# Altium schematic sheet Pegasus.SchDoc
size Tabloid; SheetNumber: 2; SheetTotal: 3
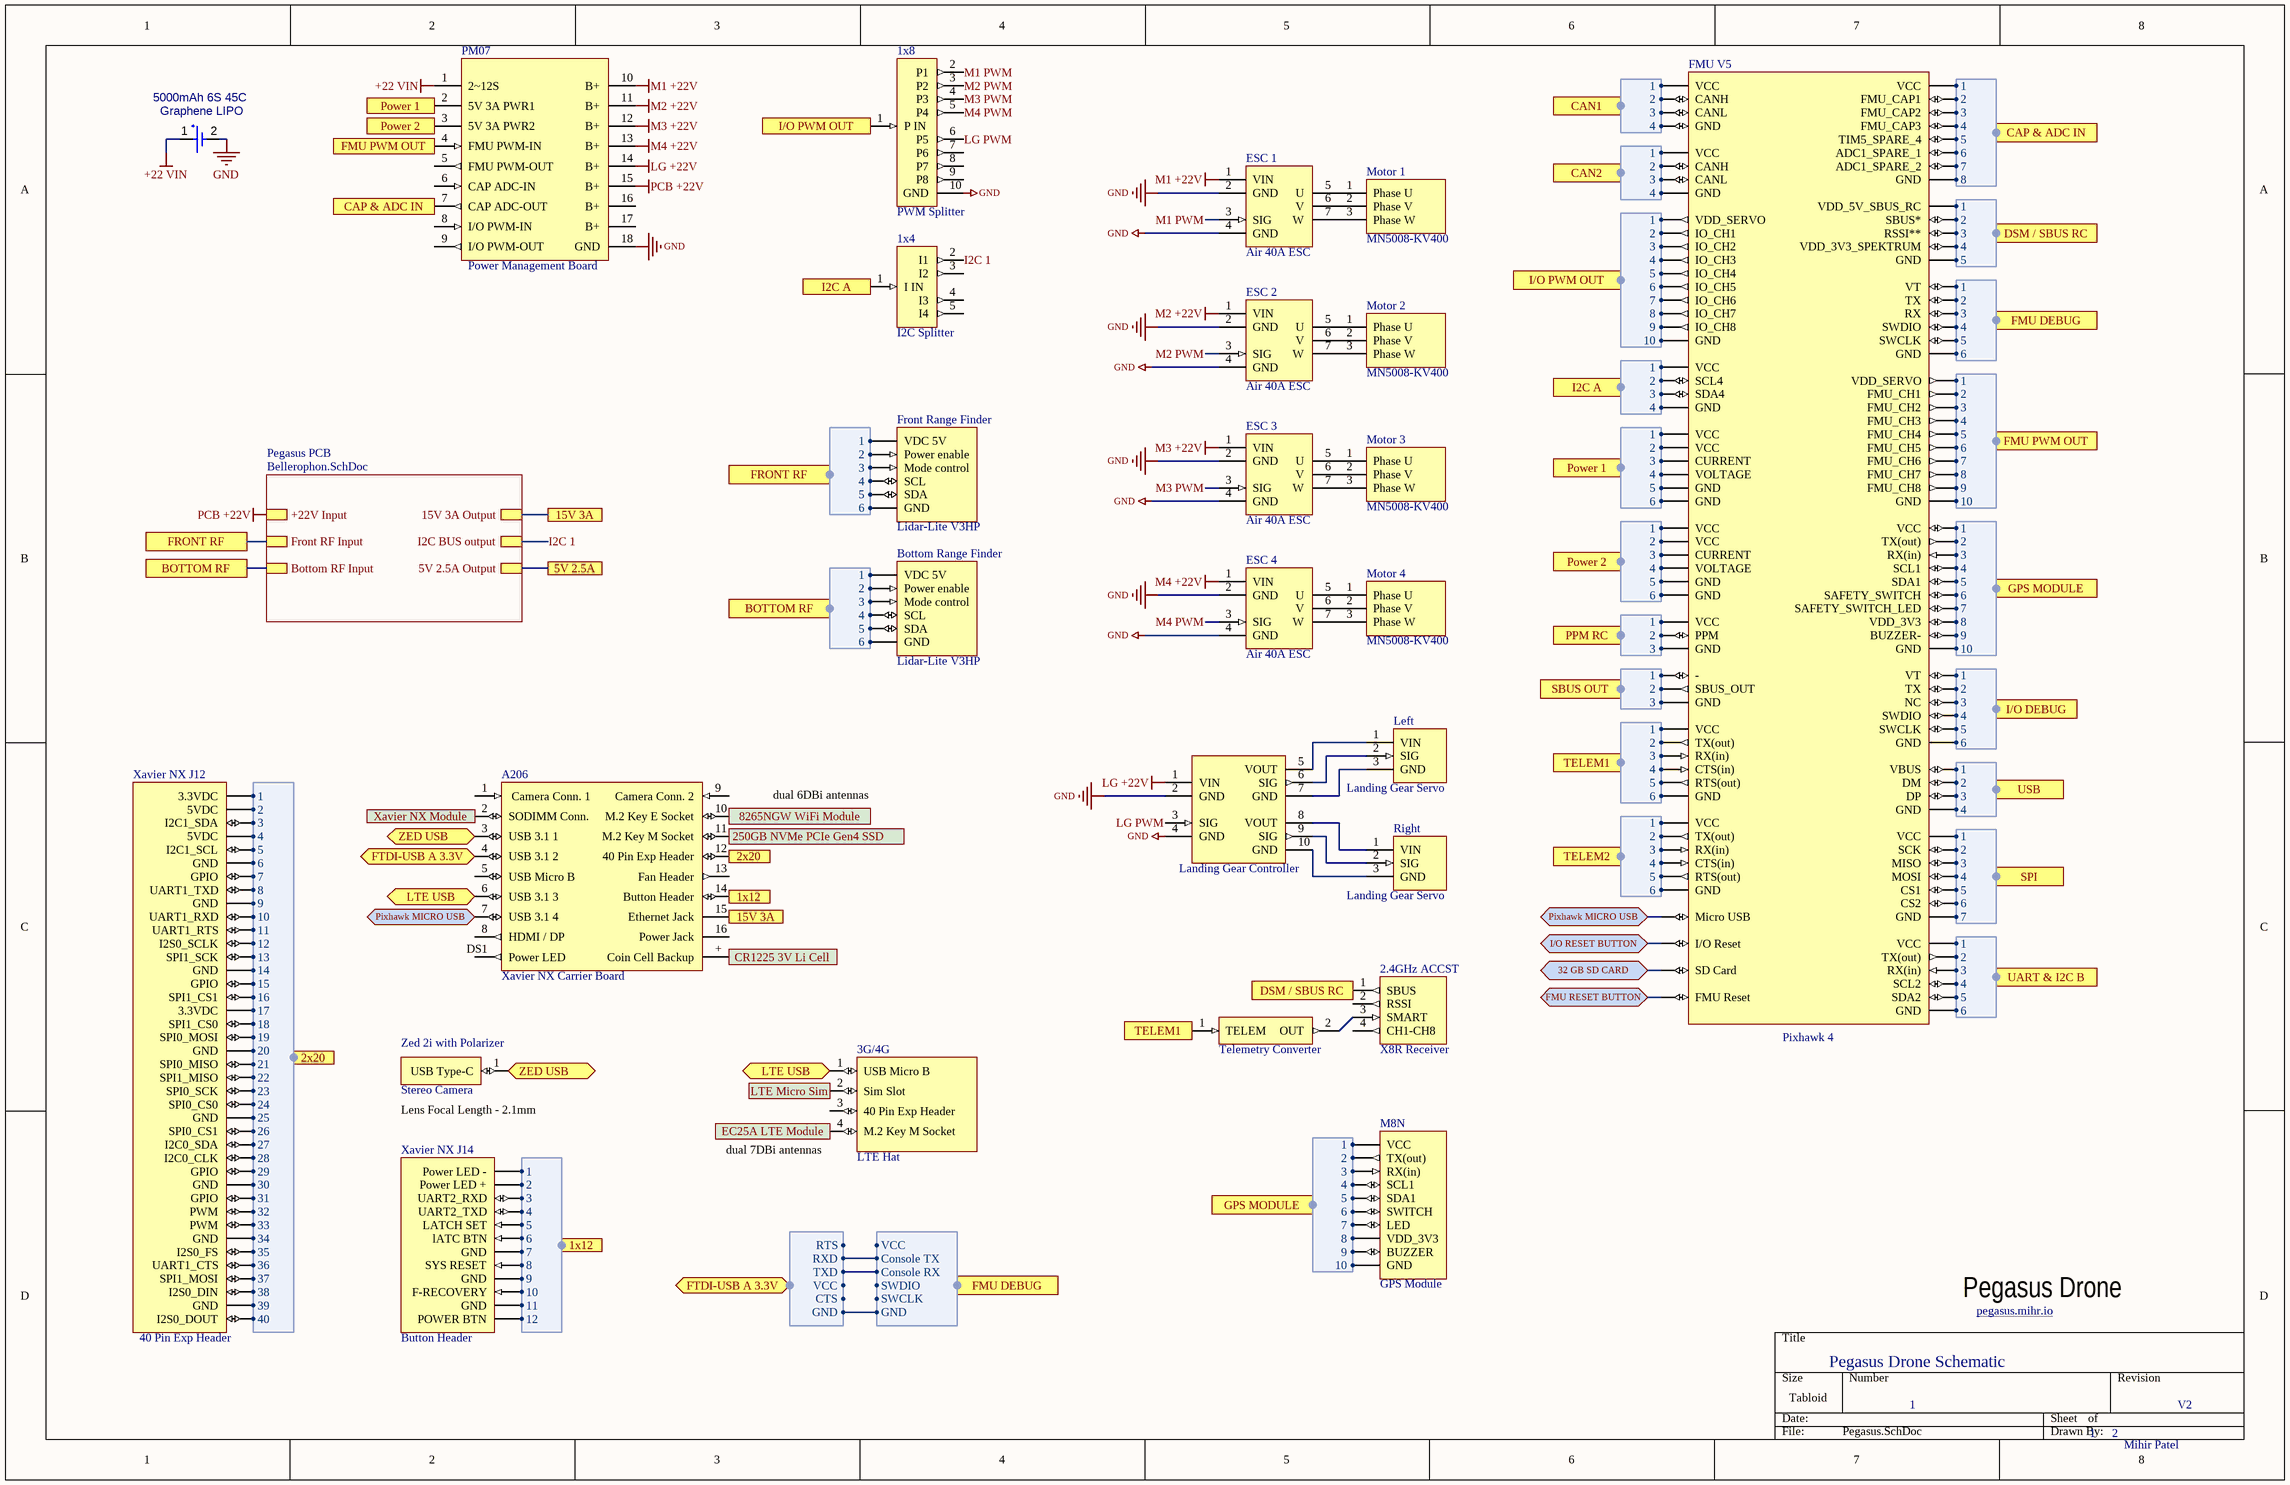
[diagram p0: Pegasus.SchDoc]

## Parts
1x4  I2C Splitter
1x8  PWM Splitter
2.4GHz_ACCST  X8R Receiver
3G/4G  LTE Hat
5000mAh_6S_45C  Graphene LIPO  [SEIK-MS621FE-FL11E-2_V]
A206  Xavier NX Carrier Board
Bottom_Range_Finder  Lidar-Lite V3HP
ESC_1  Air 40A ESC
ESC_2  Air 40A ESC
ESC_3  Air 40A ESC
ESC_4  Air 40A ESC
FMU_V5  Pixhawk 4
Front_Range_Finder  Lidar-Lite V3HP
Left  Landing Gear Servo
LGC  Landing Gear Controller
M8N  GPS Module
Motor_1  MN5008-KV400
Motor_2  MN5008-KV400
Motor_3  MN5008-KV400
Motor_4  MN5008-KV400
PM07  Power Management Board
Right  Landing Gear Servo
TC1  Telemetry Converter
Xavier_NX_J12  40 Pin Exp Header
Xavier_NX_J14  Button Header
Zed_2i_with_Polarizer  Stereo Camera

## Sub-sheets
Pegasus PCB = Bellerophon.SchDoc: 15V 3A Output, +22V Input, Front RF Input, Bottom RF Input, I2C BUS output, 5V 2.5A Output

## Ports
1x12 (harness 1x12), 1x12 (harness *), 2x20 (harness NX), 5V 2.5A, 15V 3A, 32 GB SD CARD (bidir), 250GB NVMe PCIe Gen4 SSD, 8265NGW WiFi Module, BOTTOM RF (harness L2), CAN1 (harness CAN1), CAN2 (harness CAN2), CAP & ADC IN (harness CAP & ADC IN), CR1225 3V Li Cell, DSM / SBUS RC (harness DSM / SBUS RC), EC25A LTE Module, FMU DEBUG (harness FDD), FMU DEBUG (harness FMU DEBUG), FMU PWM OUT (harness FMU PWM OUT), FMU RESET BUTTON (bidir), FRONT RF (harness L1), FTDI-USB A 3.3V (bidir, harness USBD), GPS MODULE (harness GPS MODULE), GPS MODULE (harness GPS), I2C A (harness I2C A), I/O DEBUG (harness IO DEBUG), I/O PWM OUT (harness I/O PWM OUT), I/O RESET BUTTON (bidir), LTE Micro Sim, LTE USB (bidir), Pixhawk MICRO USB (bidir), Power 1 (harness Power 1), Power 2 (harness Power 2), PPM RC (harness PPM RC), SBUS OUT (harness SBUS OUT), SPI (harness SPI), TELEM1 (harness TELEM1), TELEM2 (harness TELEM2), UART & I2C B (harness UART & I2C B), USB (harness USB), Xavier NX Module, ZED USB (bidir)

## Harnesses
CAP & ADC IN: 1, 2, 3, 4, 5, 6, 7, 8
DSM / SBUS RC: 1, 2, 3, 4, 5
FMU DEBUG: 1, 2, 3, 4, 5, 6
FMU PWM OUT: 1, 2, 3, 4, 5, 6, 7, 8, 9, 10
IO DEBUG: 1, 2, 3, 4, 5, 6
SPI: 1, 2, 3, 4, 5, 6, 7
CAN1: 1, 2, 3, 4
CAN2: 1, 2, 3, 4
I/O PWM OUT: 1, 2, 3, 4, 5, 6, 7, 8, 9, 10
I2C A: 1, 2, 3, 4
Power 1: 1, 2, 3, 4, 5, 6
Power 2: 1, 2, 3, 4, 5, 6
SBUS OUT: 1, 2, 3
TELEM1: 1, 2, 3, 4, 5, 6
TELEM2: 1, 2, 3, 4, 5, 6
GPS MODULE: 1, 2, 3, 4, 5, 6, 7, 8, 9, 10
PPM RC: 1, 2, 3
USB: 1, 2, 3, 4
UART & I2C B: 1, 2, 3, 4, 5, 6
L1: 1, 2, 3, 4, 5, 6
L2: 1, 2, 3, 4, 5, 6
GPS: 1, 2, 3, 4, 5, 6, 7, 8, 9, 10
NX: 1, 2, 3, 4, 5, 6, 7, 8, 9, 10, 11, 12, 13, 14, 15, 16, 17, 18, 19, 20, 21, 22, 23, 24, 25, 26, 27, 28, 29, 30, 31, 32, 33, 34, 35, 36, 37, 38, 39, 40
1x12: 1, 2, 3, 4, 5, 6, 7, 8, 9, 10, 11, 12
FDD: VCC, Console TX, Console RX, SWDIO, SWCLK, GND
USBD: GND, CTS, VCC, TXD, RXD, RTS

## Nets
+22 VIN: 5000mAh_6S_45C.1(+) PM07.1(2~12S)
GND: 1x8.10(GND) 5000mAh_6S_45C.2(-) ESC_1.2(GND) ESC_1.4(GND) ESC_2.2(GND) ESC_2.4(GND) ESC_3.2(GND) ESC_3.4(GND) ESC_4.2(GND) ESC_4.4(GND) LGC.2(GND) LGC.4(GND) PM07.18(GND)
LG +22V: LGC.1(VIN) PM07.14(B+)
M1 +22V: ESC_1.1(VIN) PM07.10(B+)
M2 +22V: ESC_2.1(VIN) PM07.11(B+)
M3 +22V: ESC_3.1(VIN) PM07.12(B+)
M4 +22V: ESC_4.1(VIN) PM07.13(B+)
PCB +22V: PM07.15(B+) ; sheet Pegasus PCB/+22V Input
5V 2.5A: port 5V 2.5A, sheet Pegasus PCB/5V 2.5A Output
15V 3A: A206.15(Ethernet_Jack) ; port 15V 3A, sheet Pegasus PCB/15V 3A Output
32 GB SD CARD: FMU_V5.117(SD_Card) ; port 32 GB SD CARD
250GB NVMe PCIe Gen4 SSD: A206.11(M.2_Key_M_Socket) ; port 250GB NVMe PCIe Gen4 SSD
8265NGW WiFi Module: A206.10(M.2_Key_E_Socket) ; port 8265NGW WiFi Module
CR1225 3V Li Cell: A206.+(Coin_Cell_Backup) ; port CR1225 3V Li Cell
EC25A LTE Module: 3G/4G.4(M.2_Key_M_Socket) ; port EC25A LTE Module
FMU RESET BUTTON: FMU_V5.118(FMU_Reset) ; port FMU RESET BUTTON
I2C 1: 1x4.2(I1) ; sheet Pegasus PCB/I2C BUS output
I/O RESET BUTTON: FMU_V5.116(I/O_Reset) ; port I/O RESET BUTTON
LG PWM: 1x8.6(P5) LGC.3(SIG)
LTE Micro Sim: 3G/4G.2(Sim_Slot) ; port LTE Micro Sim
LTE USB: 3G/4G.1(USB_Micro_B) A206.6(USB_3.1_3) ; port LTE USB
M1 PWM: 1x8.2(P1) ESC_1.3(SIG)
M2 PWM: 1x8.3(P2) ESC_2.3(SIG)
M3 PWM: 1x8.4(P3) ESC_3.3(SIG)
M4 PWM: 1x8.5(P4) ESC_4.3(SIG)
Pixhawk MICRO USB: A206.7(USB_3.1_4) FMU_V5.115(Micro_USB) ; port Pixhawk MICRO USB
Xavier NX Module: A206.2(SODIMM_Conn.) ; port Xavier NX Module
ZED USB: A206.3(USB_3.1_1) Zed_2i_with_Polarizer.1(USB_Type-C) ; port ZED USB
Net2.4GHz_ACCST_3: 2.4GHz_ACCST.3(SMART) TC1.2(OUT)
NetBottom_Range_Finder_1: Bottom_Range_Finder.1(VDC_5V) ; port BOTTOM RF.1
NetBottom_Range_Finder_2: Bottom_Range_Finder.2(Power_enable) ; port BOTTOM RF.2
NetBottom_Range_Finder_3: Bottom_Range_Finder.3(Mode_control) ; port BOTTOM RF.3
NetBottom_Range_Finder_4: Bottom_Range_Finder.4(SCL) ; port BOTTOM RF.4
NetBottom_Range_Finder_5: Bottom_Range_Finder.5(SDA) ; port BOTTOM RF.5
NetBottom_Range_Finder_6: Bottom_Range_Finder.6(GND) ; port BOTTOM RF.6
NetESC_1_5: ESC_1.5(U) Motor_1.1(Phase_U)
NetESC_1_6: ESC_1.6(V) Motor_1.2(Phase_V)
NetESC_1_7: ESC_1.7(W) Motor_1.3(Phase_W)
NetESC_2_5: ESC_2.5(U) Motor_2.1(Phase_U)
NetESC_2_6: ESC_2.6(V) Motor_2.2(Phase_V)
NetESC_2_7: ESC_2.7(W) Motor_2.3(Phase_W)
NetESC_3_5: ESC_3.5(U) Motor_3.1(Phase_U)
NetESC_3_6: ESC_3.6(V) Motor_3.2(Phase_V)
NetESC_3_7: ESC_3.7(W) Motor_3.3(Phase_W)
NetESC_4_5: ESC_4.5(U) Motor_4.1(Phase_U)
NetESC_4_6: ESC_4.6(V) Motor_4.2(Phase_V)
NetESC_4_7: ESC_4.7(W) Motor_4.3(Phase_W)
NetFMU_V5_1: FMU_V5.1(VCC) ; port Power 1.1
NetFMU_V5_2: FMU_V5.2(VCC) ; port Power 1.2
NetFMU_V5_3: FMU_V5.3(CURRENT) ; port Power 1.3
NetFMU_V5_4: FMU_V5.4(VOLTAGE) ; port Power 1.4
NetFMU_V5_5: FMU_V5.5(GND) ; port Power 1.5
NetFMU_V5_6: FMU_V5.6(GND) ; port Power 1.6
NetFMU_V5_7: FMU_V5.7(VCC) ; port Power 2.1
NetFMU_V5_8: FMU_V5.8(VCC) ; port Power 2.2
NetFMU_V5_9: FMU_V5.9(CURRENT) ; port Power 2.3
NetFMU_V5_10: FMU_V5.10(VOLTAGE) ; port Power 2.4
NetFMU_V5_11: FMU_V5.11(GND) ; port Power 2.5
NetFMU_V5_12: FMU_V5.12(GND) ; port Power 2.6
NetFMU_V5_13: FMU_V5.13(VCC) ; port TELEM1.1
NetFMU_V5_14: FMU_V5.14(TX(out)) ; port TELEM1.2
NetFMU_V5_15: FMU_V5.15(RX(in)) ; port TELEM1.3
NetFMU_V5_16: FMU_V5.16(CTS(in)) ; port TELEM1.4
NetFMU_V5_17: FMU_V5.17(RTS(out)) ; port TELEM1.5
NetFMU_V5_18: FMU_V5.18(GND) ; port TELEM1.6
NetFMU_V5_19: FMU_V5.19(VBUS) ; port USB.1
NetFMU_V5_20: FMU_V5.20(DM) ; port USB.2
NetFMU_V5_21: FMU_V5.21(DP) ; port USB.3
NetFMU_V5_22: FMU_V5.22(GND) ; port USB.4
NetFMU_V5_23: FMU_V5.23(VCC) ; port TELEM2.1
NetFMU_V5_24: FMU_V5.24(TX(out)) ; port TELEM2.2
NetFMU_V5_25: FMU_V5.25(RX(in)) ; port TELEM2.3
NetFMU_V5_26: FMU_V5.26(CTS(in)) ; port TELEM2.4
NetFMU_V5_27: FMU_V5.27(RTS(out)) ; port TELEM2.5
NetFMU_V5_28: FMU_V5.28(GND) ; port TELEM2.6
NetFMU_V5_29: FMU_V5.29(VCC) ; port CAN1.1
NetFMU_V5_30: FMU_V5.30(CANH) ; port CAN1.2
NetFMU_V5_31: FMU_V5.31(CANL) ; port CAN1.3
NetFMU_V5_32: FMU_V5.32(GND) ; port CAN1.4
NetFMU_V5_33: FMU_V5.33(VCC) ; port I2C A.1
NetFMU_V5_34: FMU_V5.34(SCL4) ; port I2C A.2
NetFMU_V5_35: FMU_V5.35(SDA4) ; port I2C A.3
NetFMU_V5_36: FMU_V5.36(GND) ; port I2C A.4
NetFMU_V5_37: FMU_V5.37(VCC) ; port CAN2.1
NetFMU_V5_38: FMU_V5.38(CANH) ; port CAN2.2
NetFMU_V5_39: FMU_V5.39(CANL) ; port CAN2.3
NetFMU_V5_40: FMU_V5.40(GND) ; port CAN2.4
NetFMU_V5_41: FMU_V5.41(-) ; port SBUS OUT.1
NetFMU_V5_42: FMU_V5.42(SBUS_OUT) ; port SBUS OUT.2
NetFMU_V5_43: FMU_V5.43(GND) ; port SBUS OUT.3
NetFMU_V5_44: FMU_V5.44(VCC) ; port PPM RC.1
NetFMU_V5_45: FMU_V5.45(PPM) ; port PPM RC.2
NetFMU_V5_46: FMU_V5.46(GND) ; port PPM RC.3
NetFMU_V5_47: FMU_V5.47(VDD_SERVO) ; port I/O PWM OUT.1
NetFMU_V5_48: FMU_V5.48(IO_CH1) ; port I/O PWM OUT.2
NetFMU_V5_49: FMU_V5.49(IO_CH2) ; port I/O PWM OUT.3
NetFMU_V5_50: FMU_V5.50(IO_CH3) ; port I/O PWM OUT.4
NetFMU_V5_51: FMU_V5.51(IO_CH4) ; port I/O PWM OUT.5
NetFMU_V5_52: FMU_V5.52(IO_CH5) ; port I/O PWM OUT.6
NetFMU_V5_53: FMU_V5.53(IO_CH6) ; port I/O PWM OUT.7
NetFMU_V5_54: FMU_V5.54(IO_CH7) ; port I/O PWM OUT.8
NetFMU_V5_55: FMU_V5.55(IO_CH8) ; port I/O PWM OUT.9
NetFMU_V5_56: FMU_V5.56(GND) ; port I/O PWM OUT.10
NetFMU_V5_57: FMU_V5.57(VCC) ; port UART & I2C B.1
NetFMU_V5_58: FMU_V5.58(TX(out)) ; port UART & I2C B.2
NetFMU_V5_59: FMU_V5.59(RX(in)) ; port UART & I2C B.3
NetFMU_V5_60: FMU_V5.60(SCL2) ; port UART & I2C B.4
NetFMU_V5_61: FMU_V5.61(SDA2) ; port UART & I2C B.5
NetFMU_V5_62: FMU_V5.62(GND) ; port UART & I2C B.6
NetFMU_V5_63: FMU_V5.63(VDD_5V_SBUS_RC) ; port DSM / SBUS RC.1
NetFMU_V5_64: FMU_V5.64(SBUS*) ; port DSM / SBUS RC.2
NetFMU_V5_65: FMU_V5.65(RSSI**) ; port DSM / SBUS RC.3
NetFMU_V5_66: FMU_V5.66(VDD_3V3_SPEKTRUM) ; port DSM / SBUS RC.4
NetFMU_V5_67: FMU_V5.67(GND) ; port DSM / SBUS RC.5
NetFMU_V5_68: FMU_V5.68(VCC) ; port CAP & ADC IN.1
NetFMU_V5_69: FMU_V5.69(FMU_CAP1) ; port CAP & ADC IN.2
NetFMU_V5_70: FMU_V5.70(FMU_CAP2) ; port CAP & ADC IN.3
NetFMU_V5_71: FMU_V5.71(FMU_CAP3) ; port CAP & ADC IN.4
NetFMU_V5_72: FMU_V5.72(TIM5_SPARE_4) ; port CAP & ADC IN.5
NetFMU_V5_73: FMU_V5.73(ADC1_SPARE_1) ; port CAP & ADC IN.6
NetFMU_V5_74: FMU_V5.74(ADC1_SPARE_2) ; port CAP & ADC IN.7
NetFMU_V5_75: FMU_V5.75(GND) ; port CAP & ADC IN.8
NetFMU_V5_76: FMU_V5.76(VCC) M8N.1(VCC) ; port GPS MODULE.1
NetFMU_V5_77: FMU_V5.77(TX(out)) M8N.2(TX(out)) ; port GPS MODULE.2
NetFMU_V5_78: FMU_V5.78(RX(in)) M8N.3(RX(in)) ; port GPS MODULE.3
NetFMU_V5_79: FMU_V5.79(SCL1) M8N.4(SCL1) ; port GPS MODULE.4
NetFMU_V5_80: FMU_V5.80(SDA1) M8N.5(SDA1) ; port GPS MODULE.5
NetFMU_V5_81: FMU_V5.81(SAFETY_SWITCH) M8N.6(SWITCH) ; port GPS MODULE.6
NetFMU_V5_82: FMU_V5.82(SAFETY_SWITCH_LED) M8N.7(LED) ; port GPS MODULE.7
NetFMU_V5_83: FMU_V5.83(VDD_3V3) M8N.8(VDD_3V3) ; port GPS MODULE.8
NetFMU_V5_84: FMU_V5.84(BUZZER-) M8N.9(BUZZER) ; port GPS MODULE.9
NetFMU_V5_85: FMU_V5.85(GND) M8N.10(GND) ; port GPS MODULE.10
NetFMU_V5_86: FMU_V5.86(VCC) ; port SPI.1
NetFMU_V5_87: FMU_V5.87(SCK) ; port SPI.2
NetFMU_V5_88: FMU_V5.88(MISO) ; port SPI.3
NetFMU_V5_89: FMU_V5.89(MOSI) ; port SPI.4
NetFMU_V5_90: FMU_V5.90(CS1) ; port SPI.5
NetFMU_V5_91: FMU_V5.91(CS2) ; port SPI.6
NetFMU_V5_92: FMU_V5.92(GND) ; port SPI.7
NetFMU_V5_93: FMU_V5.93(VDD_SERVO) ; port FMU PWM OUT.1
NetFMU_V5_94: FMU_V5.94(FMU_CH1) ; port FMU PWM OUT.2
NetFMU_V5_95: FMU_V5.95(FMU_CH2) ; port FMU PWM OUT.3
NetFMU_V5_96: FMU_V5.96(FMU_CH3) ; port FMU PWM OUT.4
NetFMU_V5_97: FMU_V5.97(FMU_CH4) ; port FMU PWM OUT.5
NetFMU_V5_98: FMU_V5.98(FMU_CH5) ; port FMU PWM OUT.6
NetFMU_V5_99: FMU_V5.99(FMU_CH6) ; port FMU PWM OUT.7
NetFMU_V5_100: FMU_V5.100(FMU_CH7) ; port FMU PWM OUT.8
NetFMU_V5_101: FMU_V5.101(FMU_CH8) ; port FMU PWM OUT.9
NetFMU_V5_102: FMU_V5.102(GND) ; port FMU PWM OUT.10
NetFMU_V5_103: FMU_V5.103(VT) ; port FMU DEBUG.1
NetFMU_V5_104: FMU_V5.104(TX) ; port FMU DEBUG.2
NetFMU_V5_105: FMU_V5.105(RX) ; port FMU DEBUG.3
NetFMU_V5_106: FMU_V5.106(SWDIO) ; port FMU DEBUG.4
NetFMU_V5_107: FMU_V5.107(SWCLK) ; port FMU DEBUG.5
NetFMU_V5_108: FMU_V5.108(GND) ; port FMU DEBUG.6
NetFMU_V5_109: FMU_V5.109(VT) ; port I/O DEBUG.1
NetFMU_V5_110: FMU_V5.110(TX) ; port I/O DEBUG.2
NetFMU_V5_111: FMU_V5.111(NC) ; port I/O DEBUG.3
NetFMU_V5_112: FMU_V5.112(SWDIO) ; port I/O DEBUG.4
NetFMU_V5_113: FMU_V5.113(SWCLK) ; port I/O DEBUG.5
NetFMU_V5_114: FMU_V5.114(GND) ; port I/O DEBUG.6
NetFront_Range_Finder_1: Front_Range_Finder.1(VDC_5V) ; port FRONT RF.1
NetFront_Range_Finder_2: Front_Range_Finder.2(Power_enable) ; port FRONT RF.2
NetFront_Range_Finder_3: Front_Range_Finder.3(Mode_control) ; port FRONT RF.3
NetFront_Range_Finder_4: Front_Range_Finder.4(SCL) ; port FRONT RF.4
NetFront_Range_Finder_5: Front_Range_Finder.5(SDA) ; port FRONT RF.5
NetFront_Range_Finder_6: Front_Range_Finder.6(GND) ; port FRONT RF.6
NetLeft_1: Left.1(VIN) LGC.5(VOUT)
NetLeft_2: Left.2(SIG) LGC.6(SIG)
NetLeft_3: Left.3(GND) LGC.7(GND)
NetLGC_8: LGC.8(VOUT) Right.1(VIN)
NetLGC_9: LGC.9(SIG) Right.2(SIG)
NetLGC_10: LGC.10(GND) Right.3(GND)
NetXavier_NX_J12_1: Xavier_NX_J12.1(3.3VDC) ; port 2x20.1
NetXavier_NX_J12_2: Xavier_NX_J12.2(5VDC) ; port 2x20.2
NetXavier_NX_J12_3: Xavier_NX_J12.3(I2C1_SDA) ; port 2x20.3
NetXavier_NX_J12_4: Xavier_NX_J12.4(5VDC) ; port 2x20.4
NetXavier_NX_J12_5: Xavier_NX_J12.5(I2C1_SCL) ; port 2x20.5
NetXavier_NX_J12_6: Xavier_NX_J12.6(GND) ; port 2x20.6
NetXavier_NX_J12_7: Xavier_NX_J12.7(GPIO) ; port 2x20.7
NetXavier_NX_J12_8: Xavier_NX_J12.8(UART1_TXD) ; port 2x20.8
NetXavier_NX_J12_9: Xavier_NX_J12.9(GND) ; port 2x20.9
NetXavier_NX_J12_10: Xavier_NX_J12.10(UART1_RXD) ; port 2x20.10
NetXavier_NX_J12_11: Xavier_NX_J12.11(UART1_RTS) ; port 2x20.11
NetXavier_NX_J12_12: Xavier_NX_J12.12(I2S0_SCLK) ; port 2x20.12
NetXavier_NX_J12_13: Xavier_NX_J12.13(SPI1_SCK) ; port 2x20.13
NetXavier_NX_J12_14: Xavier_NX_J12.14(GND) ; port 2x20.14
NetXavier_NX_J12_15: Xavier_NX_J12.15(GPIO) ; port 2x20.15
NetXavier_NX_J12_16: Xavier_NX_J12.16(SPI1_CS1) ; port 2x20.16
NetXavier_NX_J12_17: Xavier_NX_J12.17(3.3VDC) ; port 2x20.17
NetXavier_NX_J12_18: Xavier_NX_J12.18(SPI1_CS0) ; port 2x20.18
NetXavier_NX_J12_19: Xavier_NX_J12.19(SPI0_MOSI) ; port 2x20.19
NetXavier_NX_J12_20: Xavier_NX_J12.20(GND) ; port 2x20.20
NetXavier_NX_J12_21: Xavier_NX_J12.21(SPI0_MISO) ; port 2x20.21
NetXavier_NX_J12_22: Xavier_NX_J12.22(SPI1_MISO) ; port 2x20.22
NetXavier_NX_J12_23: Xavier_NX_J12.23(SPI0_SCK) ; port 2x20.23
NetXavier_NX_J12_24: Xavier_NX_J12.24(SPI0_CS0) ; port 2x20.24
NetXavier_NX_J12_25: Xavier_NX_J12.25(GND) ; port 2x20.25
NetXavier_NX_J12_26: Xavier_NX_J12.26(SPI0_CS1) ; port 2x20.26
NetXavier_NX_J12_27: Xavier_NX_J12.27(I2C0_SDA) ; port 2x20.27
NetXavier_NX_J12_28: Xavier_NX_J12.28(I2C0_CLK) ; port 2x20.28
NetXavier_NX_J12_29: Xavier_NX_J12.29(GPIO) ; port 2x20.29
NetXavier_NX_J12_30: Xavier_NX_J12.30(GND) ; port 2x20.30
NetXavier_NX_J12_31: Xavier_NX_J12.31(GPIO) ; port 2x20.31
NetXavier_NX_J12_32: Xavier_NX_J12.32(PWM) ; port 2x20.32
NetXavier_NX_J12_33: Xavier_NX_J12.33(PWM) ; port 2x20.33
NetXavier_NX_J12_34: Xavier_NX_J12.34(GND) ; port 2x20.34
NetXavier_NX_J12_35: Xavier_NX_J12.35(I2S0_FS) ; port 2x20.35
NetXavier_NX_J12_36: Xavier_NX_J12.36(UART1_CTS) ; port 2x20.36
NetXavier_NX_J12_37: Xavier_NX_J12.37(SPI1_MOSI) ; port 2x20.37
NetXavier_NX_J12_38: Xavier_NX_J12.38(I2S0_DIN) ; port 2x20.38
NetXavier_NX_J12_39: Xavier_NX_J12.39(GND) ; port 2x20.39
NetXavier_NX_J12_40: Xavier_NX_J12.40(I2S0_DOUT) ; port 2x20.40
NetXavier_NX_J14_1: Xavier_NX_J14.1(Power_LED_-) ; port 1x12.1
NetXavier_NX_J14_2: Xavier_NX_J14.2(Power_LED_+) ; port 1x12.2
NetXavier_NX_J14_3: Xavier_NX_J14.3(UART2_RXD) ; port 1x12.3
NetXavier_NX_J14_4: Xavier_NX_J14.4(UART2_TXD) ; port 1x12.4
NetXavier_NX_J14_5: Xavier_NX_J14.5(LATCH_SET) ; port 1x12.5
NetXavier_NX_J14_6: Xavier_NX_J14.6(lATC_BTN) ; port 1x12.6
NetXavier_NX_J14_7: Xavier_NX_J14.7(GND) ; port 1x12.7
NetXavier_NX_J14_8: Xavier_NX_J14.8(SYS_RESET) ; port 1x12.8
NetXavier_NX_J14_9: Xavier_NX_J14.9(GND) ; port 1x12.9
NetXavier_NX_J14_10: Xavier_NX_J14.10(F-RECOVERY) ; port 1x12.10
NetXavier_NX_J14_11: Xavier_NX_J14.11(GND) ; port 1x12.11
NetXavier_NX_J14_12: Xavier_NX_J14.12(POWER_BTN) ; port 1x12.12
(unnamed): port FMU DEBUG.Console TX, port FTDI-USB A 3.3V.RXD
(unnamed): port FMU DEBUG.Console RX, port FTDI-USB A 3.3V.TXD
(unnamed): port FMU DEBUG.GND, port FTDI-USB A 3.3V.GND

Not connected (* = marked no-connect by the designer): 1x4 1(I_IN) 3(I2) 4(I3) 5(I4); 1x8 1(P_IN) 7(P6) 8(P7) 9(P8); 2.4GHz_ACCST 1(SBUS) 2(RSSI) 4(CH1-CH8); 3G/4G 3(40_Pin_Exp_Header); A206 1(_Camera_Conn._1) 4(USB_3.1_2) 5(USB_Micro_B) 8(HDMI_/_DP) 9(Camera_Conn._2) 12(40_Pin_Exp_Header) 13(Fan_Header) 14(Button_Header) 16(Power_Jack) DS1(Power_LED); PM07 2(5V_3A_PWR1) 3(5V_3A_PWR2) 4(FMU_PWM-IN) 5(FMU_PWM-OUT) 6(CAP_ADC-IN) 7(CAP_ADC-OUT) 8(I/O_PWM-IN) 9(I/O_PWM-OUT) 16(B+) 17(B+); TC1 1(TELEM)

## Notes on the sheet
- dual 6DBi antennas
- Lens Focal Length - 2.1mm
- (near 3G/4G) dual 7DBi antennas
- Pegasus Drone
- Pegasus Drone Schematic
- pegasus.mihr.io <http://pegasus.mihr.io>
- 1
- 2
- V2
- Mihir Patel

## Library data of the parts
1x4 = CMP-00028-00024-3: Holybro I2C Splitter
1x8 = CMP-00028-00022-4: Holybro PWM Splitter
2.4GHz_ACCST = CMP-00028-00023-1: FrSky 2.4GHz ACCST
3G/4G = CMP-00028-00027-5: Sixfab LTE Module
5000mAh_6S_45C = CMP-00029-00000-1: MS Lihium Rechargeable Battery, 3 V, -20 to 60 degC, Tray; RoHS Compliant: NotApplicable; Mounting Technology: WithLeads; Pins: 2
A206 = CMP-00028-00029-2: A206
Bottom_Range_Finder Front_Range_Finder = CMP-00028-00011-7: Garmin Lidar
ESC_1-ESC_4 = CMP-00028-00016-7: T-Motor ESC 600 Hz
FMU_V5 = CMP-00028-00018-8: FMU V5
Left Right = CMP-00028-00019-3: Tarot 650 Landing Gear Servo Motor
LGC = CMP-00028-00020-2: Tarot 650 LG Controller
M8N = CMP-00028-00021-1: Pixhawk 4 GPS Module
Motor_1-Motor_4 = CMP-00028-00017-4: KV400
PM07 = CMP-00028-00007-5: Holybro Power Module
TC1 = CMP-00028-00026-1: FrSky Yappu Telemetry Converter Cable
Xavier_NX_J12 = CMP-00028-00030-3: Xavier NX Header
Xavier_NX_J14 = CMP-00028-00031-2: Xavier 12 pin J12 Button Header
Zed_2i_with_Polarizer = CMP-00028-00028-2: Zed 2i